# EAGLE schematic sandbox (EAGLE 7.7.0)
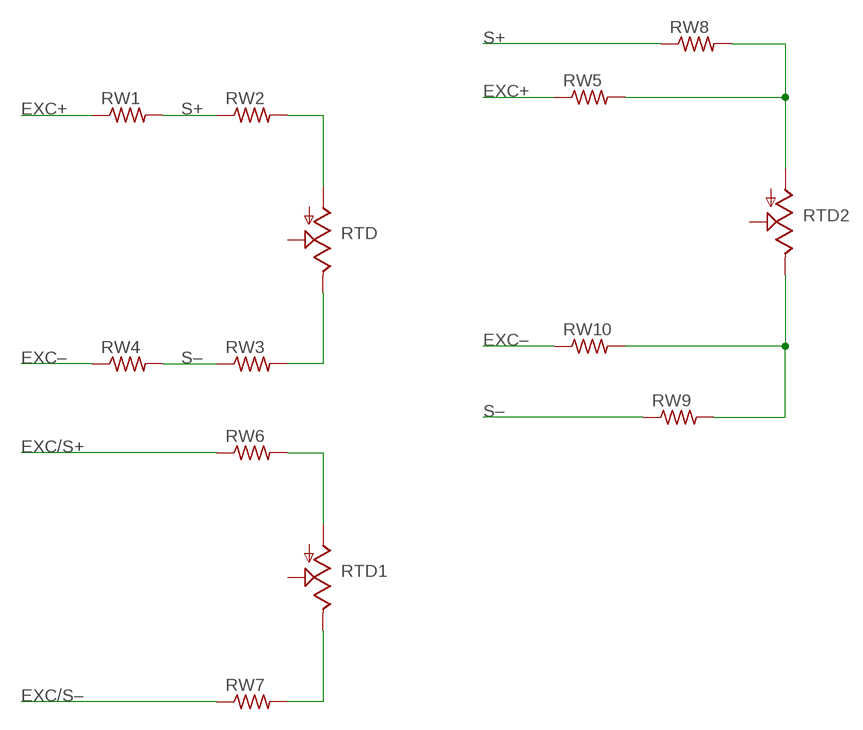
[diagram p0: schematic, sheet 1]

## Parts
RTD  TRIM_US-3223G  [3223G]
RTD1  TRIM_US-3223G  [3223G]
RTD2  TRIM_US-3223G  [3223G]
RW1  R-US_R0603  [R0603]
RW2  R-US_R0603  [R0603]
RW3  R-US_R0603  [R0603]
RW4  R-US_R0603  [R0603]
RW5  R-US_R0603  [R0603]
RW6  R-US_R0603  [R0603]
RW7  R-US_R0603  [R0603]
RW8  R-US_R0603  [R0603]
RW9  R-US_R0603  [R0603]
RW10  R-US_R0603  [R0603]

## Nets
EXC+: RW1.1 RW5.1
EXC/S+: RW6.1
EXC/S–: RW7.1
EXC–: RW4.1 RW10.1
N$1: RTD1.1(A) RW6.2
N$2: RTD1.3(E) RW7.2
N$3: RTD.1(A) RW2.2
N$4: RTD.3(E) RW3.2
N$5: RTD2.1(A) RW5.2 RW8.2
N$6: RTD2.3(E) RW9.2 RW10.2
S+: RW1.2 RW2.1 RW8.1
S–: RW3.1 RW4.2 RW9.1
Unconnected: RTD1.2(S) RTD2.2(S) RTD.2(S)

## Library data of the parts
RTD RTD1 RTD2 = pot:TRIM_US-: POTENTIOMETER
RW1-RW10 = rcl:R-US_: RESISTOR, American symbol